# Altium schematic sheet MCU B.SchDoc
size A4; Organization: Altium Limited; Address1: L3, 12a Rodborough Rd; Address2: Frenchs Forest; Address3: NSW; Address4: Australia 2086; Revision: 0; Status: Develop
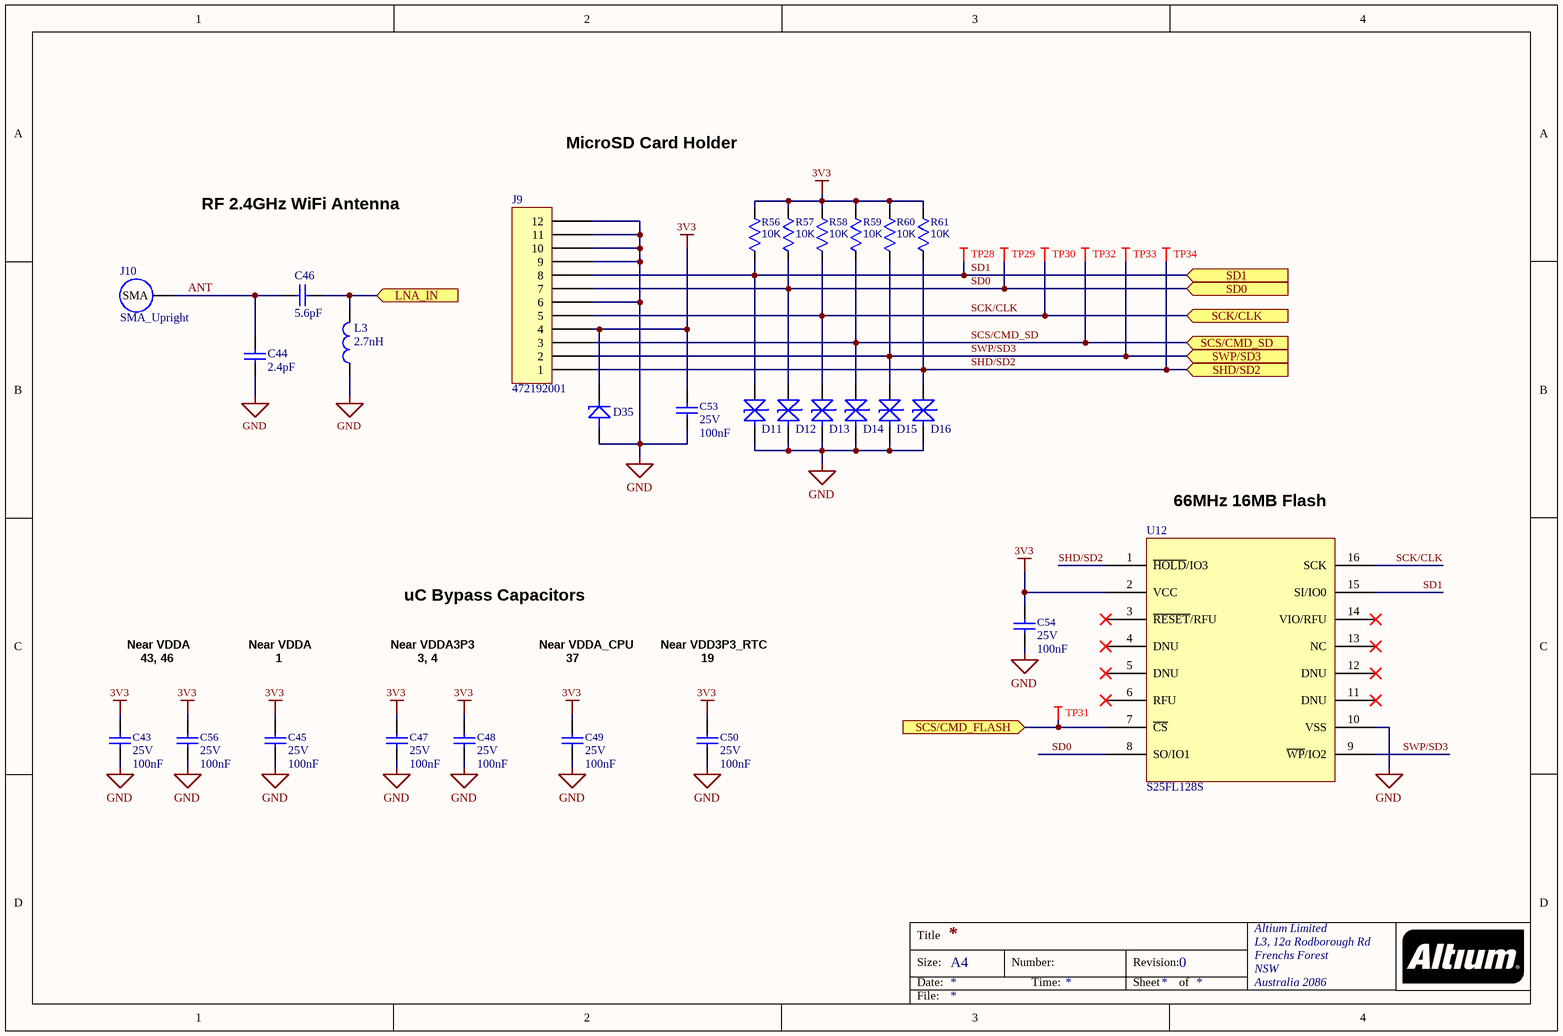
[diagram p0: MCU B.SchDoc]

## Parts
C43  value 100nF  Voltage: 25V  [CAPC1005X06N]  (hidden comment: 4.7uF)
C44  2.4pF  [C1608[0603]]
C45  value 100nF  Voltage: 25V  [CAPC1005X06N]  (hidden comment: 4.7uF)
C46  5.6pF  [C1608[0603]]
C47  value 100nF  Voltage: 25V  [CAPC1005X06N]  (hidden comment: 4.7uF)
C48  value 100nF  Voltage: 25V  [CAPC1005X06N]  (hidden comment: 4.7uF)
C49  value 100nF  Voltage: 25V  [CAPC1005X06N]  (hidden comment: 4.7uF)
C50  value 100nF  Voltage: 25V  [CAPC1005X06N]  (hidden comment: 4.7uF)
C53  value 100nF  Voltage: 25V  [CAPC1005X06N]  (hidden comment: 4.7uF)
C54  value 100nF  Voltage: 25V  [CAPC1005X06N]  (hidden comment: 4.7uF)
C56  value 100nF  Voltage: 25V  [CAPC1005X06N]  (hidden comment: 4.7uF)
D11  ESD7951ST5GOSCT-ND  [SODFL100X40-2N]  (value not drawn)
D12  ESD7951ST5GOSCT-ND  [SODFL100X40-2N]  (value not drawn)
D13  ESD7951ST5GOSCT-ND  [SODFL100X40-2N]  (value not drawn)
D14  ESD7951ST5GOSCT-ND  [SODFL100X40-2N]  (value not drawn)
D15  ESD7951ST5GOSCT-ND  [SODFL100X40-2N]  (value not drawn)
D16  ESD7951ST5GOSCT-ND  [SODFL100X40-2N]  (value not drawn)
D35  3.3V TVS  [NXP PTVSxS1UR-Series (SOD123W)]  (value not drawn)
J9  472192001  [SD-47219-001]
J10  SMA_Upright  [TE_5-1814400-1 Upright]
L3  2.7nH  [L1608[0603]]
R56  10K  [RESC1005X03N]
R57  10K  [RESC1005X03N]
R58  10K  [RESC1005X03N]
R59  10K  [RESC1005X03N]
R60  10K  [RESC1005X03N]
R61  10K  [RESC1005X03N]
TP28  PAD  [TP_SMD_39MIL]  (value not drawn)  (no BOM)
TP29  PAD  [TP_SMD_39MIL]  (value not drawn)  (no BOM)
TP30  PAD  [TP_SMD_39MIL]  (value not drawn)  (no BOM)
TP31  PAD  [TP_SMD_39MIL]  (value not drawn)  (no BOM)
TP32  PAD  [TP_SMD_39MIL]  (value not drawn)  (no BOM)
TP33  PAD  [TP_SMD_39MIL]  (value not drawn)  (no BOM)
TP34  PAD  [TP_SMD_39MIL]  (value not drawn)  (no BOM)
U12  S25FL128S  [SOIC127P1030X265-16N]

## Ports
LNA_IN (in), SCK/CLK (in), SCS/CMD_FLASH (in), SCS/CMD_SD (in), SD0 (in), SD1 (in), SHD/SD2 (in), SWP/SD3 (in)

## Nets
3V3: C43.1 C45.1 C47.1 C48.1 C49.1 C50.1 C53.1 C54.1 C56.1 D35.1 J9.4 R56.2 R57.2 R58.2 R59.2 R60.2 R61.2 U12.2(VCC)
GND: C43.2 C44.1 C45.2 C47.2 C48.2 C49.2 C50.2 C53.2 C54.2 C56.2 D11.1(CATHODE) D12.1(CATHODE) D13.1(CATHODE) D14.1(CATHODE) D15.1(CATHODE) D16.1(CATHODE) D35.2 J9.6 J9.9 J9.10 J9.11 J9.12 L3.1 U12.10(VSS)
ANT: C44.2 C46.2 J10.1(SMA)
LNA_IN: C46.1 L3.2 ; port LNA_IN
SCK/CLK: D13.2(ANODE) J9.5 R58.1 TP30.1 U12.16(SCK) ; port SCK/CLK
SCS/CMD_FLASH: TP31.1 U12.7(~{CS}) ; port SCS/CMD_FLASH
SCS/CMD_SD: D14.2(ANODE) J9.3 R59.1 TP32.1 ; port SCS/CMD_SD
SD0: D12.2(ANODE) J9.7 R57.1 TP29.1 U12.8(SO/IO1) ; port SD0
SD1: D11.2(ANODE) J9.8 R56.1 TP28.1 U12.15(SI/IO0) ; port SD1
SHD/SD2: D16.2(ANODE) J9.1 R61.1 TP34.1 U12.1(~{HOLD}/IO3) ; port SHD/SD2
SWP/SD3: D15.2(ANODE) J9.2 R60.1 TP33.1 U12.9(~{WP}/IO2) ; port SWP/SD3

Not connected (* = marked no-connect by the designer): U12 3(~{RESET}/RFU)* 4(DNU)* 5(DNU)* 6(RFU)* 11(DNU)* 12(DNU)* 13(NC)* 14(VIO/RFU)*

## Notes on the sheet
- MicroSD Card Holder
- RF 2.4GHz WiFi Antenna
- 66MHz 16MB Flash
- Near VDDA
- Near VDDA3P3
- uC Bypass Capacitors
- Near VDDA_CPU
- Near VDD3P3_RTC
- 43, 46
- 1
- 3, 4
- 37
- 19
- Title
- Size:
- Date:
- A4
- Number:
- Time:
- Revision:
- Sheet
- of
- File:

## Library data of the parts
C43 C45 C47-C50 C53 C54 C56 = 4.7uF_0603_10V: Manufacturer Part Number: CL05A104KA5NNNC; Manufacturer: Samsung; ComponentLink1URL: http://www.murata.com/~/media/webrenewal/support/library/catalog/products/capacitor/mlcc/c02e.pdf; ComponentLink1Description: http://www.murata.com/~/media/webrenewal/support/library/catalog/products/capacitor/mlcc/c02e.pdf; Supplier 1: Digi-Key; Supplier Part Number 1: 1276-1043-1-ND
C44 = 2.4pF_0603_100V: Cap,2.4pF,100V,C0G/NP0,RF,0603; Manufacturer Part Number: GQM1885C2A2R4BB01D; Manufacturer: Murata Electronics North America; Supplier 1: Digi-Key; Supplier Part Number 1: 490-6093-1-ND
C46 = 5.6pF_0603_200V: Cap,5.6pF,200V,C0G/NP0,RF,0603; Manufacturer Part Number: C0603C569C5GACTU; Manufacturer: KEMET; Supplier 1: Digi-Key; Supplier Part Number 1: 399-7944-1-ND
D11-D16 = ESD7951S: TVS Diode; Manufacturer: ON Semiconductor; Supplier Part Number 1: ESD7951ST5GOSCT-ND; Manufacturer Part Number: ESD7951ST5G; Supplier 1: Digi-Key
D35 = NXP PTVSxS1UR-Series: Manufacturer: Nexperia; Manufacturer Part Number: PTVS3V3S1UTR,115; Supplier 1: Digi-Key; Supplier Part Number 1: 1727-1416-1-ND
J9 = CON12: Manufacturer: Molex; Manufacturer Part Number: 0472192001; Supplier Part Number 1: WM6698CT-ND; Supplier 1: Digi-Key
J10 = SMA_Upright: Manufacturer: Molex; Manufacturer Part Number: 0733910070; Supplier 1: Digi-Key; Supplier Part Number 1: WM5544-ND
L3 = 2.7nH_0603: Ind,2.7nH,300mA,100mOhm DCR,13@100MHz,0603; Manufacturer Part Number: L0603C2N7SRMST; Manufacturer: KEMET; Supplier 1: Digi-Key; Supplier Part Number 1: 399-9570-1-ND
R56-R61 = 1K00_0603_0.1W: RES 1K Ohm ±5%, 0.25W,1/4W 0603; Manufacturer: Panasonic; Manufacturer Part Number: ERJ-2RKF1002X; ComponentLink1URL: https://datasheet.ciiva.com/2469/esr-2469603.pdf; ComponentLink1Description: https://datasheet.ciiva.com/2469/esr-2469603.pdf; ComponentLink2URL: https://datasheet.ciiva.com/2469/esr-2469604.pdf; ComponentLink2Description: https://datasheet.ciiva.com/2469/esr-2469604.pdf; ComponentLink3URL: https://datasheet.ciiva.com/2469/esr-2469605.pdf; ComponentLink3Description: https://datasheet.ciiva.com/2469/esr-2469605.pdf; Value: 10k; Supplier 1: Digi-Key; Supplier Part Number 1: P10.0KLCT-ND
TP28-TP34 = TP_SMD_39MIL: SMD Test Pad; Manufacturer: No P/N Required; P/N: No P/N; UM: EA; Fast Supplier: No P/N Required; Fast Supplier P/N: No P/N Required; Manufacturer P/N: No P/N Required
U12 = S25FL128S: QSPI 128M Flash Memory; Manufacturer: Cypress Semiconductor Corp; Manufacturer Part Number: S25FL128SDPMFIG10; Supplier Part Number 1: 428-4172-ND; Supplier 1: Digi-Key